# EAGLE schematic HKCV4 (EAGLE 9.6.2)
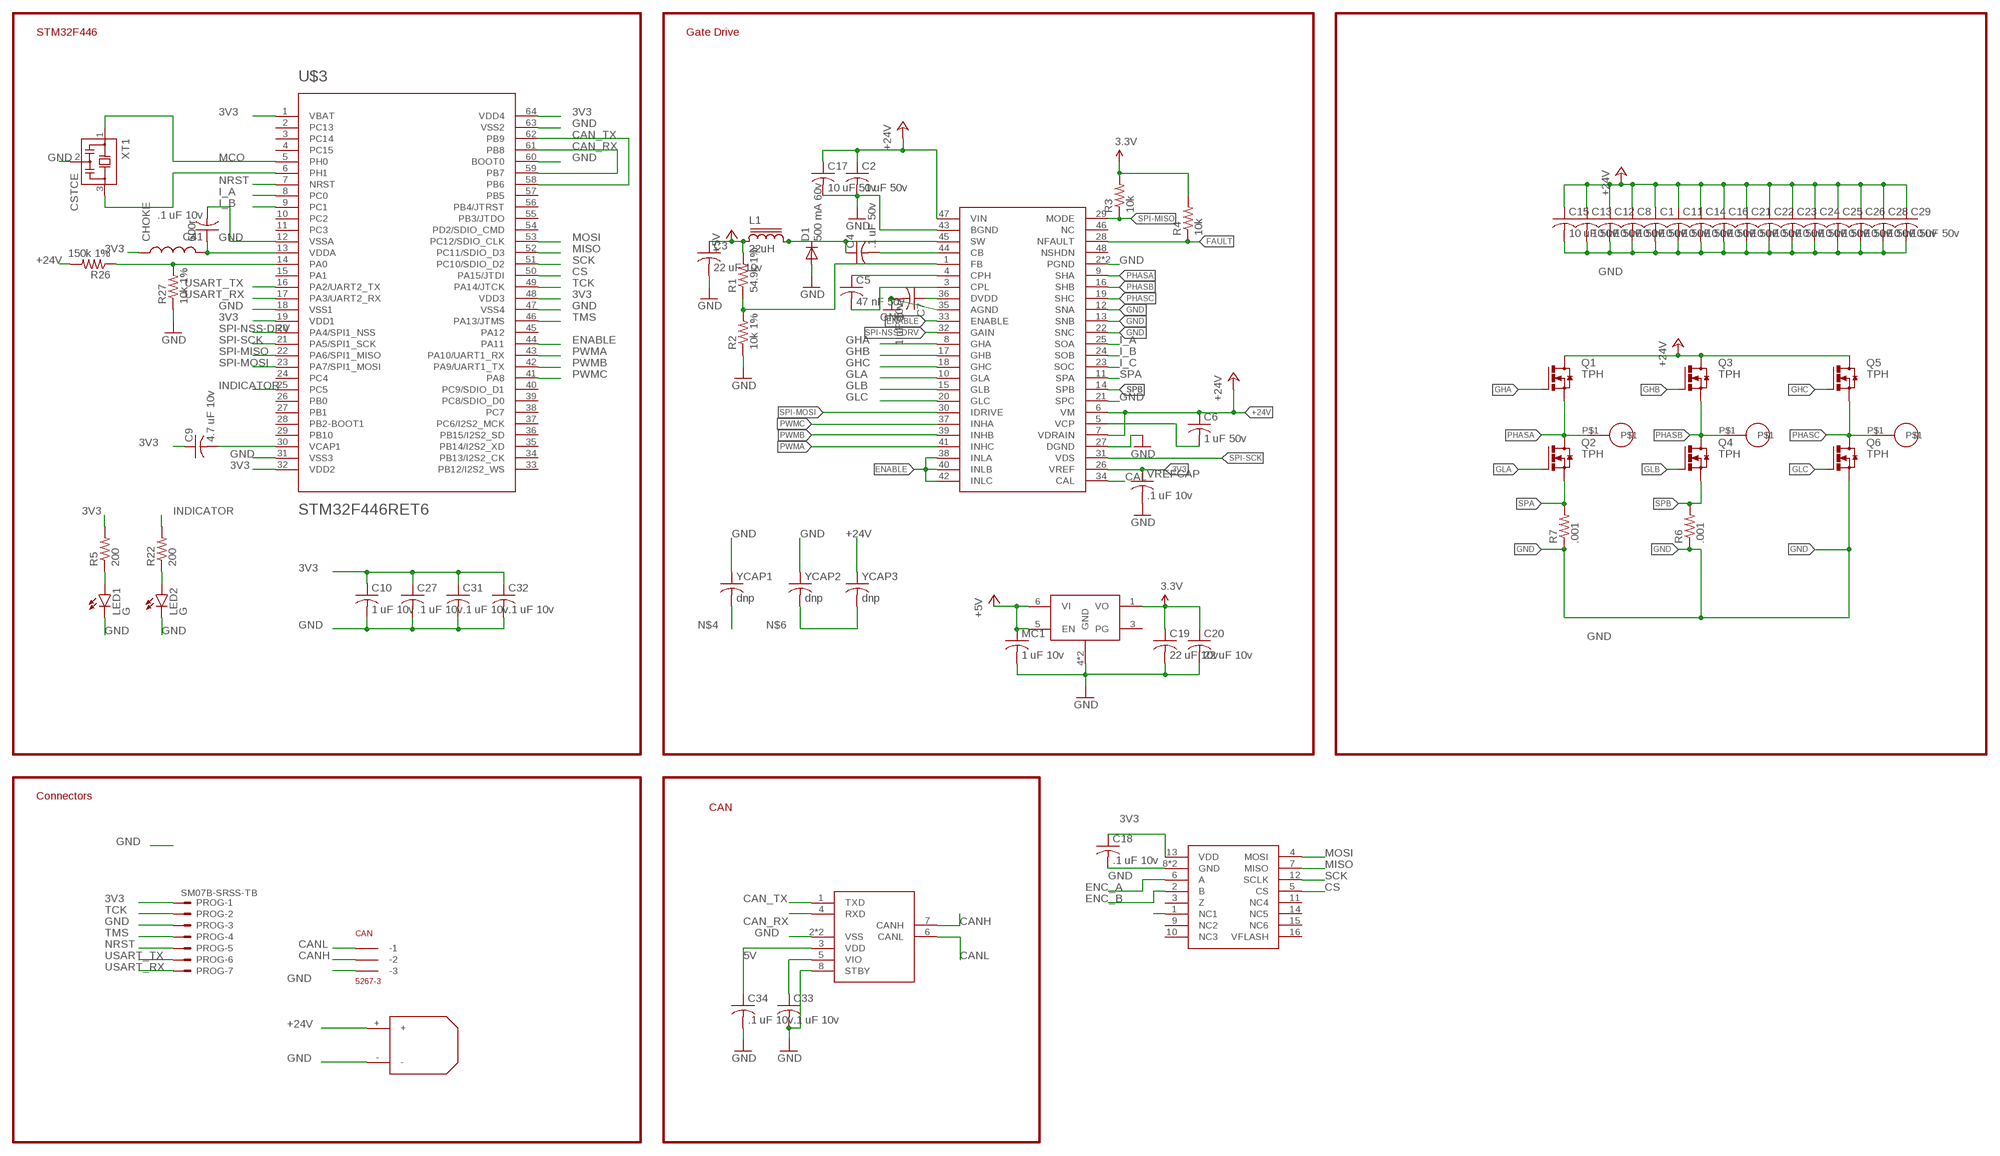
[diagram p0: schematic, sheet 1]

## Parts
C1  10 uF 50v  C-USC1206K  [C1206K]
C2  .1 uF 50v  C-USC0603K  [C0603K]
C3  22 uF 10v  C-USC0603K  [C0603K]
C4  .1 uF 50v  C-USC0603K  [C0603K]
C5  47 nF 50v  C-USC0402K  [C0402K]
C6  1 uF 50v  C-USC0603K  [C0603K]
C7  1 uF 10v  C-USC0402K  [C0402K]
C8  10 uF 50v  C-USC1206K  [C1206K]
C9  4.7 uF 10v  C-USC0402K  [C0402K]
C10  1 uF 10v  C-USC0402K  [C0402K]
C11  10 uF 50v  C-USC1206K  [C1206K]
C12  10 uF 50v  C-USC1206K  [C1206K]
C13  10 uF 50v  C-USC1206K  [C1206K]
C14  10 uF 50v  C-USC1206K  [C1206K]
C15  10 uF 50v  C-USC1206K  [C1206K]
C16  10 uF 50v  C-USC1206K  [C1206K]
C17  10 uF 50v  C-USC1206K  [C1206K]
C18  .1 uF 10v  C-USC0402K  [C0402K]
C19  22 uF 10v  C-USC0603K  [C0603K]
C20  22 uF 10v  C-USC0603K  [C0603K]
C21  10 uF 50v  C-USC1206K  [C1206K]
C22  10 uF 50v  C-USC1206K  [C1206K]
C23  10 uF 50v  C-USC1206K  [C1206K]
C24  10 uF 50v  C-USC1206K  [C1206K]
C25  10 uF 50v  C-USC1206K  [C1206K]
C26  10 uF 50v  C-USC1206K  [C1206K]
C27  .1 uF 10v  C-USC0402K  [C0402K]
C28  10 uF 50v  C-USC1206K  [C1206K]
C29  10 uF 50v  C-USC1206K  [C1206K]
C31  .1 uF 10v  C-USC0402K  [C0402K]
C32  .1 uF 10v  C-USC0402K  [C0402K]
C33  .1 uF 10v  C-USC0402K  [C0402K]
C34  .1 uF 10v  C-USC0402K  [C0402K]
C41  .1 uF 10v  C-USC0402K  [C0402K]
CAN  5267-3  [5267-3]
CHOKE  600r  INDUCTOR0603  [0603]
D1  500 mA 60v  DIODE-SOD123  [SOD123]
L1  22uH  SDR0302  [SDR0302]
LDFM33PUR  LDFM  [DFN6-3X3]
LED1  G  LED0603  [LED-0603]
LED2  G  LED0603  [LED-0603]
MC1  1 uF 10v  C-USC0402K  [C0402K]
PROG  SM07B-SRSS-TB  [SM07B-SRSS-TB]
Q1  TPH  [TRANS_TPH5900CNH,L1Q]
Q2  TPH  [TRANS_TPH5900CNH,L1Q]
Q3  TPH  [TRANS_TPH5900CNH,L1Q]
Q4  TPH  [TRANS_TPH5900CNH,L1Q]
Q5  TPH  [TRANS_TPH5900CNH,L1Q]
Q6  TPH  [TRANS_TPH5900CNH,L1Q]
R1  54.9k 1%  R-US_R0402  [R0402]
R2  10k 1%  R-US_R0402  [R0402]
R3  10k  R-US_R0402  [R0402]
R4  10k  R-US_R0402  [R0402]
R5  200  R-US_R0402  [R0402]
R6  .001  R-US_R1210  [R1210]
R7  .001  R-US_R1210  [R1210]
R22  200  R-US_R0402  [R0402]
R26  150k 1%  R-US_R0402  [R0402]
R27  10k 1%  R-US_R0402  [R0402]
U$1  DRV8323RH  [QFN50P700X700X90-49N]
U$2  18_AWG_PAD  [18_AWG_PAD]
U$3  STM32F446RET6  [TQFP64]
U$4  18_AWG_PAD  [18_AWG_PAD]
U$5  18_AWG_PAD  [18_AWG_PAD]
U$6  MCP2542  [TDFN]
U$9  XT30  [XT30_HORIZONTAL]
U$11  MA700  [QFN16]
VREFCAP  .1 uF 10v  C-USC0402K  [C0402K]
XT1  CSTCE  [CSTCE]
YCAP1  dnp  C-USC0402K  [C0402K]
YCAP2  dnp  C-USC0402K  [C0402K]
YCAP3  dnp  C-USC0402K  [C0402K]

## Nets
3V3: C9.1 C10.1 C18.1 C19.1 C20.1 C27.1 C31.1 C32.1 C33.1 CHOKE.1 LDFM33PUR.1(VO) PROG.1 R3.2 R4.2 R5.2 U$1.26(VREF) U$3.1(VBAT) U$3.19(VDD1) U$3.32(VDD2) U$3.48(VDD3) U$3.64(VDD4) U$6.5(VIO) U$11.13(VDD) VREFCAP.1 ; supply symbol labelled 3.3V
5V: C3.1 C34.1 L1.1 LDFM33PUR.5(EN) LDFM33PUR.6(VI) MC1.1 R1.2 U$6.3(VDD) ; supply symbol labelled +5V
+24V: C1.1 C2.1 C6.1 C8.1 C11.1 C12.1 C13.1 C14.1 C15.1 C16.1 C17.1 C21.1 C22.1 C23.1 C24.1 C25.1 C26.1 C28.1 C29.1 Q1.5(D) Q1.6(D) Q1.7(D) Q1.8(D) Q1.EP(D) Q3.5(D) Q3.6(D) Q3.7(D) Q3.8(D) Q3.EP(D) Q5.5(D) Q5.6(D) Q5.7(D) Q5.8(D) Q5.EP(D) R26.2 U$1.6(VM) U$1.7(VDRAIN) U$1.47(VIN) U$9.+ YCAP3.1
BOOT: C4.2 U$1.44(CB)
CAL: U$1.34(CAL)
CAN_RX: U$3.59(PB7) U$3.61(PB8) U$6.4(RXD)
CAN_TX: U$3.58(PB6) U$3.62(PB9) U$6.1(TXD)
CANH: CAN.P$2(-2) U$6.7(CANH)
CANL: CAN.P$1(-1) U$6.6(CANL)
CPH: C5.1 U$1.4(CPH)
CPL: C5.2 U$1.3(CPL)
CS: U$3.50(PA15/JTDI) U$11.5(CS)
DEVICE3.3: C7.1 U$1.36(DVDD)
ENABLE: U$1.33(ENABLE) U$1.38(INLA) U$1.40(INLB) U$1.42(INLC) U$3.44(PA11)
ENC_A: U$11.6(A)
ENC_B: U$11.2(B)
FAULT: R4.1 U$1.28(NFAULT)
FB: R1.1 R2.2 U$1.1(FB)
GHA: Q1.4(G) U$1.8(GHA)
GHB: Q3.4(G) U$1.17(GHB)
GHC: Q5.4(G) U$1.18(GHC)
GLA: Q2.4(G) U$1.10(GLA)
GLB: Q4.4(G) U$1.15(GLB)
GLC: Q6.4(G) U$1.20(GLC)
GND: C1.2 C2.2 C3.2 C7.2 C8.2 C10.2 C11.2 C12.2 C13.2 C14.2 C15.2 C16.2 C17.2 C18.2 C19.2 C20.2 C21.2 C22.2 C23.2 C24.2 C25.2 C26.2 C27.2 C28.2 C29.2 C31.2 C32.2 C33.2 C34.2 C41.2 CAN.P$3(-3) D1.A LDFM33PUR.4(GND) LDFM33PUR.EXP(GND) LED1.C LED2.C MC1.2 PROG.3 Q6.1(S) Q6.2(S) Q6.3(S) R2.1 R6.1 R7.1 R27.1 U$1.2(PGND) U$1.12(SNA) U$1.13(SNB) U$1.21(SPC) U$1.22(SNC) U$1.27(DGND) U$1.35(AGND) U$1.43(BGND) U$1.49(PGND) U$3.12(VSSA) U$3.18(VSS1) U$3.31(VSS3) U$3.47(VSS4) U$3.60(BOOT0) U$3.63(VSS2) U$6.2(VSS) U$6.8(STBY) U$6.9(VSS) U$9.- U$11.8(GND) U$11.TH(GND) VREFCAP.2 XT1.2 YCAP1.1 YCAP2.1
I_A: U$1.25(SOA) U$3.8(PC0)
I_B: U$1.24(SOB) U$3.9(PC1)
I_C: U$1.23(SOC)
INDICATOR: R22.2 U$3.25(PC5)
MCO: U$3.5(PH0) XT1.1
MISO: U$3.52(PC11/SDIO_D3) U$11.7(MISO)
MOSI: U$3.53(PC12/SDIO_CLK) U$11.4(MOSI)
N$1: LED1.A R5.1
N$2: C41.1 CHOKE.2 U$3.13(VDDA)
N$3: C9.2 U$3.30(VCAP1)
N$4: YCAP1.2
N$6: YCAP2.2 YCAP3.2
N$9: U$11.1(NC1)
N$24: R26.1 R27.2 U$3.14(PA0)
N$28: LED2.A R22.1
N$30: U$3.6(PH1) XT1.3
NRST: PROG.5 U$3.7(NRST)
PHASA: Q1.1(S) Q1.2(S) Q1.3(S) Q2.5(D) Q2.6(D) Q2.7(D) Q2.8(D) Q2.EP(D) U$1.9(SHA) U$4.P$1
PHASB: Q3.1(S) Q3.2(S) Q3.3(S) Q4.5(D) Q4.6(D) Q4.7(D) Q4.8(D) Q4.EP(D) U$1.16(SHB) U$2.P$1
PHASC: Q5.1(S) Q5.2(S) Q5.3(S) Q6.5(D) Q6.6(D) Q6.7(D) Q6.8(D) Q6.EP(D) U$1.19(SHC) U$5.P$1
PWMA: U$1.41(INHC) U$3.43(PA10/UART1_RX)
PWMB: U$1.39(INHB) U$3.42(PA9/UART1_TX)
PWMC: U$1.37(INHA) U$3.41(PA8)
SCK: U$3.51(PC10/SDIO_D2) U$11.12(SCLK)
SPA: Q2.1(S) Q2.2(S) Q2.3(S) R7.2 U$1.11(SPA)
SPB: Q4.1(S) Q4.2(S) Q4.3(S) R6.2 U$1.14(SPB)
SPI-MISO: R3.1 U$1.29(MODE) U$3.22(PA6/SPI1_MISO)
SPI-MOSI: U$1.30(IDRIVE) U$3.23(PA7/SPI1_MOSI)
SPI-NSS-DRV: U$1.32(GAIN) U$3.20(PA4/SPI1_NSS)
SPI-SCK: U$1.31(VDS) U$3.21(PA5/SPI1_SCK)
SW: C4.1 D1.C L1.2 U$1.45(SW)
TCK: PROG.2 U$3.49(PA14/JTCK)
TMS: PROG.4 U$3.46(PA13/JTMS)
USART_RX: PROG.7 U$3.17(PA3/UART2_RX)
USART_TX: PROG.6 U$3.16(PA2/UART2_TX)
VCP: C6.2 U$1.5(VCP)
Unconnected: LDFM33PUR.3(PG) U$1.46(NC) U$1.48(NSHDN) U$3.2(PC13) U$3.3(PC14) U$3.4(PC15) U$3.10(PC2) U$3.11(PC3) U$3.15(PA1) U$3.24(PC4) U$3.26(PB0) U$3.27(PB1) U$3.28(PB2-BOOT1) U$3.29(PB10) U$3.33(PB12/I2S2_WS) U$3.34(PB13/I2S2_CK) U$3.35(PB14/I2S2_XD) U$3.36(PB15/I2S2_SD) U$3.37(PC6/I2S2_MCK) U$3.38(PC7) U$3.39(PC8/SDIO_D0) U$3.40(PC9/SDIO_D1) U$3.45(PA12) U$3.54(PD2/SDIO_CMD) U$3.55(PB3/JTDO) U$3.56(PB4/JTRST) U$3.57(PB5) U$11.3(Z) U$11.9(NC2) U$11.10(NC3) U$11.11(NC4) U$11.14(NC5) U$11.15(NC6) U$11.16(VFLASH)

## Notes on the sheet
- STM32F446 | Gate Drive
- Connectors
- CAN

## Library data of the parts
C1-C29 C31-C34 C41 MC1 VREFCAP YCAP1-YCAP3 = rcl:C-US: CAPACITOR, American symbol
CAN = con-molex-spox:5267-3
CHOKE = SparkFun-Passives:INDUCTOR: Inductors Basic Inductor/Choke - 0603 and 1206. Footprints are not proven and vary greatly between part numbers. INDUCTOR POWER 3.3UH 4.0A SMD 0.197" L x 0.197" W x 0.177" H (5.00mm x 5.00mm x 4.50mm)
D1 = diode:DIODE-: DIODE
L1 = inductor-bourns:SDR0302: POWER INDUCTOR
LDFM33PUR = BenLibrary:LDFM
LED1 LED2 = SparkFun-LED:LED: LEDs Standard schematic elements and footprints for 5mm, 3mm, 1206, and 0603 sized LEDs. 5mm - Spark Fun Electronics SKU : COM-00529 (and others)
PROG = con-jst2:?M07B-SRSS-TB: Disconnectable Crimp style connector, 1.0mm pitch 7 contacts
Q1-Q6 = transistor-power:TPH
R1-R7 R22 R26 R27 = rcl:R-US_: RESISTOR, American symbol
U$1 = BenLibrary:DRV8323RH
U$2 U$4 U$5 = BenLibrary:18_AWG_PAD
U$3 = BenLibrary:STM32F446RET6: ARM DSP Chip used on the WAV Trigger board.
U$6 = BenLibrary:MCP2542
U$9 = Ben_Library:XT30
U$11 = BenLibrary:MA700
XT1 = sc_usercreated:CSTCE